# Altium schematic sheet SD CARD.SchDoc: uSD CARD
size A4; CompanyName: STMicroelectronics; Organization: Microcontrollers Division; DocumentNumber: 1; SheetNumber: 11; SheetTotal: 19
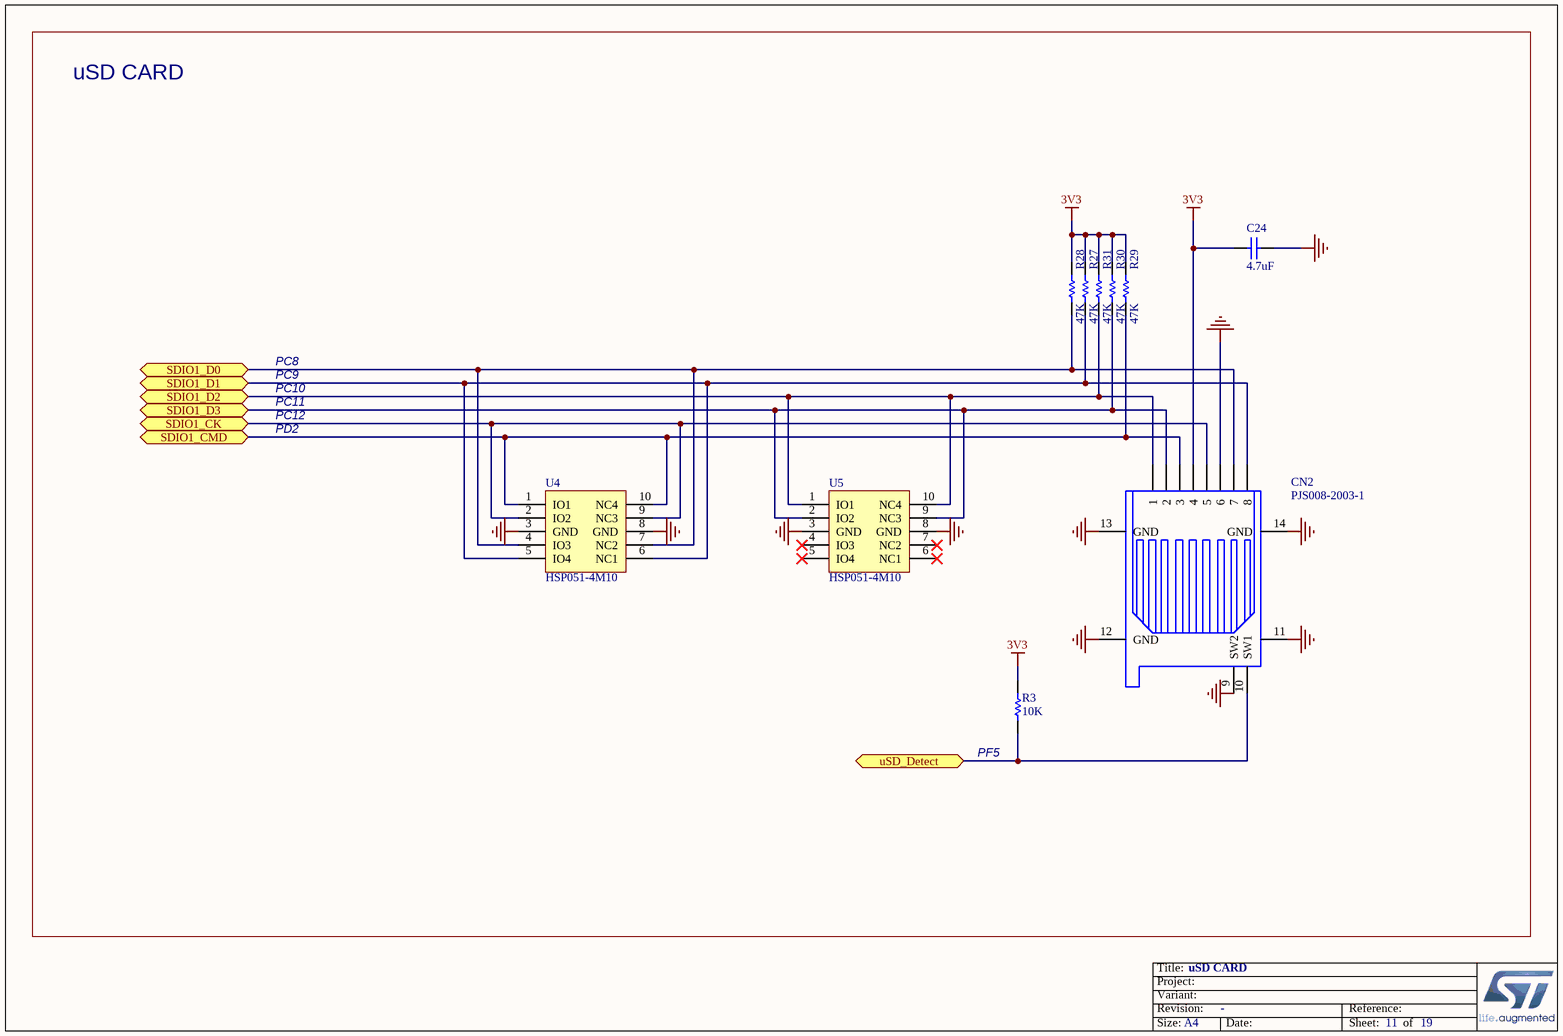
[diagram p0: SD CARD.SchDoc]

## Parts
C24  value 4.7uF  [C0603]  (hidden comment: Capacitor)
CN2  value PJS008-2003-1  [CON_MICROSD_YAMAICHI_PJS008-2003-1]  (hidden comment: microSD-PJS008-2003)
R3  value 10K  [R0603]  (hidden comment: Resistor)
R27  value 47K  [R0402]  (hidden comment: Resistor)
R28  value 47K  [R0402]  (hidden comment: Resistor)
R29  value 47K  [R0402]  (hidden comment: Resistor)
R30  value 47K  [R0402]  (hidden comment: Resistor)
R31  value 47K  [R0402]  (hidden comment: Resistor)
U4  HSP051-4M10  [ESD_UQFN-10L_2P5X1_P050]
U5  HSP051-4M10  [ESD_UQFN-10L_2P5X1_P050]

## Ports
SDIO1_CK, SDIO1_CMD, SDIO1_D0, SDIO1_D1, SDIO1_D2, SDIO1_D3, uSD_Detect

## Nets
3V3: C24.1 CN2.4 R3.2 R27.2 R28.2 R29.2 R30.2 R31.2
GND: C24.2 CN2.6 CN2.9(SW2) CN2.11(GND) CN2.12(GND) CN2.13(GND) CN2.14(GND) U4.3(GND) U4.8(GND) U5.3(GND) U5.8(GND)
SDIO1_CK: CN2.5 U4.2(IO2) U4.9(NC3) ; port SDIO1_CK
SDIO1_CMD: CN2.3 R29.1 U4.1(IO1) U4.10(NC4) ; port SDIO1_CMD
SDIO1_D0: CN2.7 R28.1 U4.4(IO3) U4.7(NC2) ; port SDIO1_D0
SDIO1_D1: CN2.8 R27.1 U4.5(IO4) U4.6(NC1) ; port SDIO1_D1
SDIO1_D2: CN2.1 R31.1 U5.1(IO1) U5.10(NC4) ; port SDIO1_D2
SDIO1_D3: CN2.2 R30.1 U5.2(IO2) U5.9(NC3) ; port SDIO1_D3
uSD_Detect: CN2.10(SW1) R3.1 ; port uSD_Detect

Not connected (* = marked no-connect by the designer): U5 4(IO3)* 5(IO4)* 6(NC1)* 7(NC2)*

## Notes on the sheet
- uSD CARD
- PC8
- PC9
- PC10
- PC11
- PC12
- PD2
- (near R3) PF5
- Title:
- Project:
- Size:
- Revision:
- Variant:
- A4
- -
- Date:
- Reference:
- Sheet:
- of

## Library data of the parts
C24 = MCD-01121: Capacitor, MLCC, 4.7µF, 10V, X5R, 20%, 0603, T=0,8mm; Manufacturer_Part_Number: GRM188R61A475ME15; Manufacturer: MURATA; ECCN_US: EAR99; ECCN_EU: NEC; Provided_By: SUBCO; Internal_Part_Number: MCD-01121; Status: Released; Part_Type: Capacitor; Package: C0603; ComponentLink1Description: Datasheet; ComponentLink1URL: http://tunmcdsvn.tun.st.com/Component_Datasheet_Library/Trunk/Capacitors/Murata_Capacitor_GR_series
CN2 = MCD-00023: MicroSD Card Conn, Reversed-Type, Mnt Push-Push, Positionning holes; Part_Type: Connector; Manufacturer: YAMAICHI; Provided_By: SUBCO; Internal_Part_Number: MCD-00023; Status: Released; Manufacturer_Part_Number: PJS008-2003-1; ComponentLink1Description: Datasheet; ComponentLink1URL: http://tunmcdsvn.tun.st.com/Component_Datasheet_Library/Trunk/Connectors/Yamaichi_Connector_microSD-Card-PJS008-2003; ECCN_US: n/a; ECCN_EU: n/a
R3 = MCD-00220: Resistor,10K,0603,1%,1/10W; Manufacturer_Part_Number: RC0603FR-0710KL; Manufacturer: YAGEO; ECCN_US: EAR99; ECCN_EU: NEC; Provided_By: SUBCO; Internal_Part_Number: MCD-00220; Status: Released; Part_Type: Resistor; Package: R0603; ComponentLink1Description: Datasheet; ComponentLink1URL: http://tunmcdsvn.tun.st.com/Component_Datasheet_Library/Trunk/Resistors/Yageo_Resistor_RC0603-series
R27-R31 = MCD-00063: Resistor,47K,0402,1%,1/16W; Manufacturer_Part_Number: RC0402FR-0747KL; Manufacturer: YAGEO; Provided_By: SUBCO; Internal_Part_Number: MCD-00063; Status: Released; Part_Type: Resistor; Package: R0402; ComponentLink1Description: Datasheet; ComponentLink1URL: http://tunmcdsvn.tun.st.com/Component_Datasheet_Library/Trunk/Resistors/Yageo_Resistor_RC0402-series
U4 U5 = MCD-00667: 4-line ESD protection for high speed lines; Part_Type: Diode; Manufacturer: STMICROELECTRONICS; BMS_Part_Number: 9179041; ECCN_US: EAR99; ECCN_EU: NEC; Provided_By: SUBCO with ST control; Internal_Part_Number: MCD-00667; Value: HSP051-4M10; Status: Checked; Manufacturer_Part_Number: HSP051-4M10; Package: uQFN-10L; ComponentLink1Description: Datasheet; ComponentLink1URL: http://tunmcdsvn.tun.st.com/Component_Datasheet_Library/Trunk/Diodes/STM_ESD_HSP051-4M10